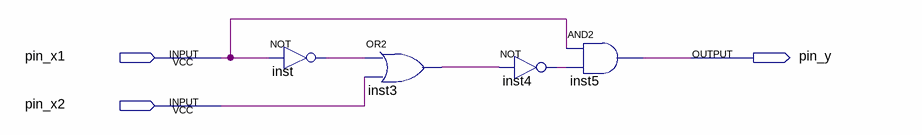
[diagram p0: schematic sheet]
// Quartus schematic Lab1.bdf as structural Verilog: 4 symbols, 3 pins
module Lab1 (
  input  pin_x1,
  input  pin_x2,
  output pin_y
);

  wire inst3_out, inst4_out, inst_out;

  not inst (inst_out, pin_x1);
  or inst3 (inst3_out, inst_out, pin_x2);
  not inst4 (inst4_out, inst3_out);
  and inst5 (pin_y, pin_x1, inst4_out);
endmodule
